# Altium schematic sheet eVV_Main Controller.SchDoc: eVV_Main Controller
size A4; DrawnBy: Ivica Matovic; Revision: 1.1; SheetNumber: 5; SheetTotal: 8
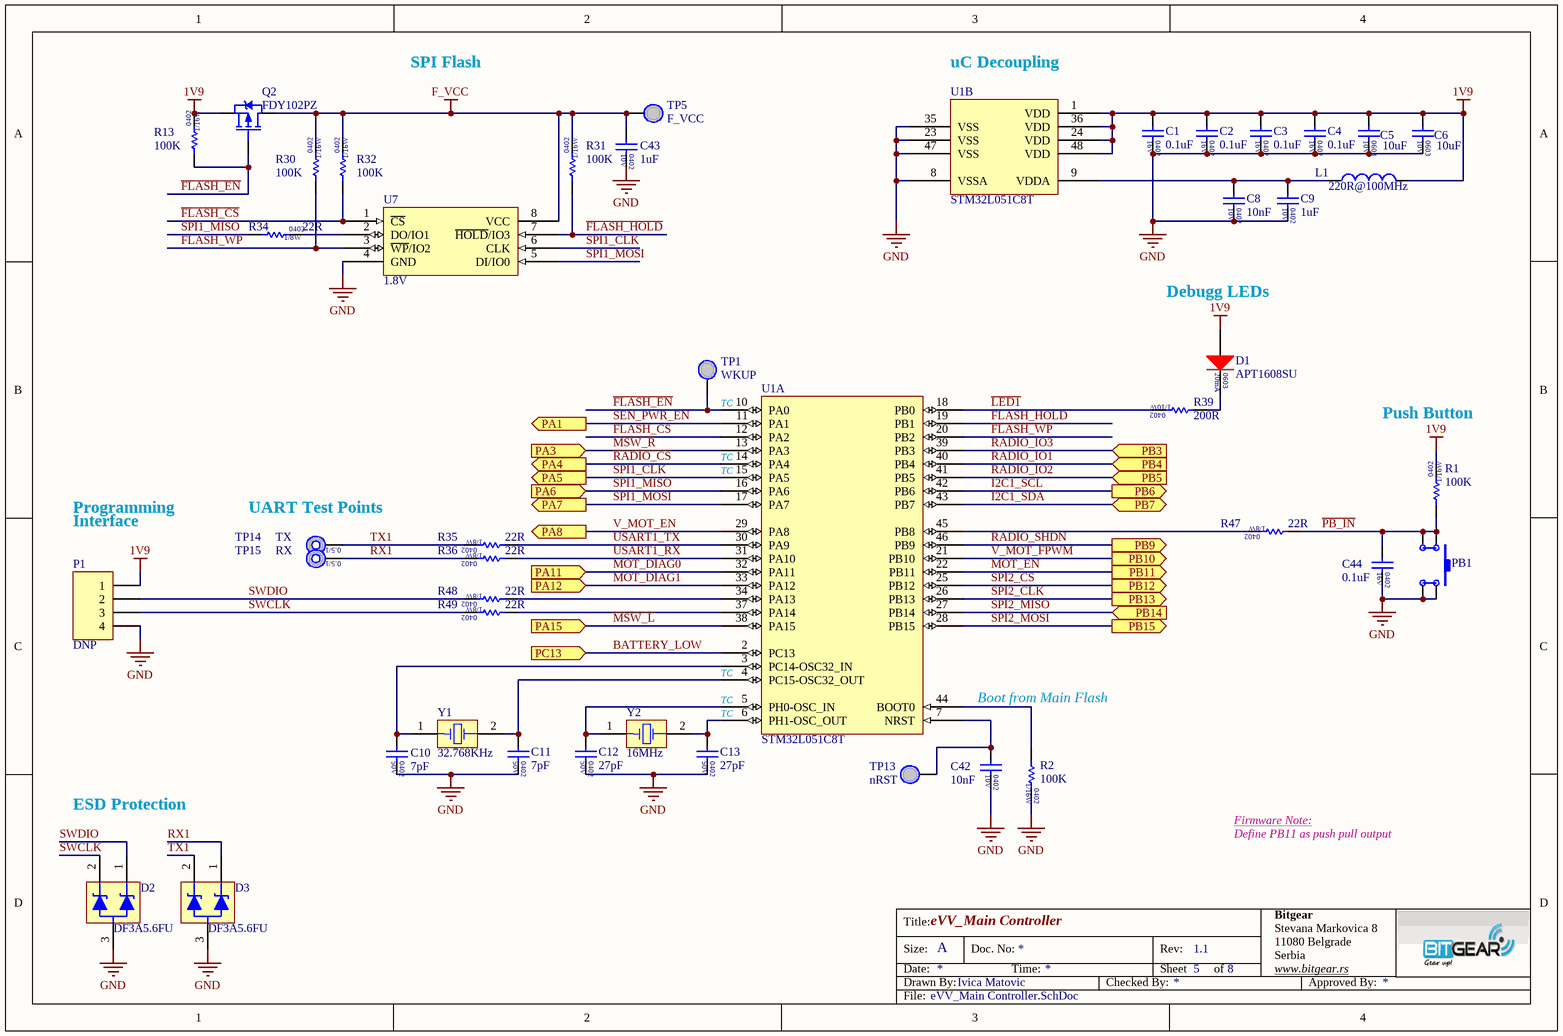
[diagram p0: eVV_Main Controller.SchDoc]

## Parts
C1  0.1uF  [CAPC1005X60N]
C2  0.1uF  [CAPC1005X60N]
C3  0.1uF  [CAPC1005X60N]
C4  0.1uF  [CAPC1005X60N]
C5  10uF  [CAPC1608X95N]
C6  10uF  [CAPC1608X95N]
C8  10nF  [CAPC1005X60N]
C9  1uF  [CAPC1005X60N]
C10  7pF  [CAPC1005X60N]
C11  7pF  [CAPC1005X60N]
C12  27pF  [CAPC1005X60N]
C13  27pF  [CAPC1005X60N]
C42  10nF  [CAPC1005X60N]
C43  1uF  [CAPC1005X60N]
C44  0.1uF  [CAPC1005X60N]
D1  APT1608SU  [DIOC1608X84N_R]
D2  DF3A5.6FU  [SOT65P210X110-3N]
D3  DF3A5.6FU  [SOT65P210X110-3N]
L1  220R@100MHz  [INDC1005X60N]
P1  DNP  [HDR1X4_100MIL]  (no BOM)
PB1  switch  [CK_KMR221NG]  (value not drawn)
Q2  FDY102PZ  [SOT50P160X78-3N]
R1  100K  [RESC1005X40AN]
R2  100K  [RESC1005X40AN]
R13  100K  [RESC1005X40AN]
R30  100K  [RESC1005X40AN]
R31  100K  [RESC1005X40AN]
R32  100K  [RESC1005X40AN]
R34  22R  [RESC1005X40AN]
R35  22R  [RESC1005X40AN]
R36  22R  [RESC1005X40AN]
R39  200R  [RESC1005X40AN]
R47  22R  [RESC1005X40AN]
R48  22R  [RESC1005X40AN]
R49  22R  [RESC1005X40AN]
TP1  WKUP  [TEST_POINT_1MM]  (no BOM)
TP5  F_VCC  [TEST_POINT_1MM]  (no BOM)
TP13  nRST  [TEST_POINT_1MM]  (no BOM)
TP14  TX  [TEST_POINT_TH_1MM]  (no BOM)
TP15  RX  [TEST_POINT_TH_1MM]  (no BOM)
U1  STM32L051C8T  [QFP50P900X900X160-48N]  (parts A,B of 2)
U7  1.8V  [SOIC127P600X175-8N]
Y1  32.768KHz  [ABS07]
Y2  16MHz  [ABM3]

## Ports
PA1 (out), PA3 (in), PA4 (out), PA5 (out), PA6 (in), PA7 (out), PA8 (out), PA11 (in), PA12 (in), PA15 (in), PB3 (in), PB4 (in), PB5 (in), PB6 (out), PB7 (bidir), PB9 (out), PB10 (out), PB11 (out), PB12 (out), PB13 (out), PB14 (in), PB15 (out), PC13 (in)

## Nets
1V9: C1.1 C2.1 C3.1 C4.1 C5.1 C6.1 D1.1(A) L1.2 P1.1 Q2.2(S) R1.1 R13.1 U1.1(VDD) U1.24(VDD) U1.36(VDD) U1.48(VDD)
F_VCC: C43.1 Q2.3(D) R30.1 R31.1 R32.1 TP5.1 U7.8(VCC)
GND: C1.2 C2.2 C3.2 C4.2 C5.2 C6.2 C8.2 C9.2 C10.2 C11.2 C12.2 C13.2 C42.2 C43.2 C44.2 D2.3(A) D3.3(A) P1.4 PB1.3 PB1.4 R2.1 U1.8(VSSA) U1.23(VSS) U1.35(VSS) U1.47(VSS) U7.4(GND)
~{LED1}: R39.1 U1.18(PB0)
~{MSW_L}: U1.38(PA15) ; port PA15
~{MSW_R}: U1.13(PA3) ; port PA3
~{PB_IN}: C44.1 PB1.1 PB1.2 R1.2 R47.2
BATTERY_LOW: U1.2(PC13) ; port PC13
~{FLASH_CS}: R32.2 U1.12(PA2) U7.1(~{CS})
~{FLASH_EN}: Q2.1(G) R13.2 TP1.1 U1.10(PA0)
~{FLASH_HOLD}: R31.2 U1.19(PB1) U7.7(~{HOLD}/IO3)
~{FLASH_WP}: R30.2 U1.20(PB2) U7.3(~{WP}/IO2)
I2C1_SCL: U1.42(PB6) ; port PB6
I2C1_SDA: U1.43(PB7) ; port PB7
MOT_DIAG0: U1.32(PA11) ; port PA11
MOT_DIAG1: U1.33(PA12) ; port PA12
MOT_EN: U1.22(PB11) ; port PB11
~{RADIO_CS}: U1.14(PA4) ; port PA4
RADIO_IO1: U1.40(PB4) ; port PB4
RADIO_IO2: U1.41(PB5) ; port PB5
RADIO_IO3: U1.39(PB3) ; port PB3
RADIO_SHDN: U1.46(PB9) ; port PB9
RX1: D3.1(C1) R36.1 TP15.1
SEN_PWR_EN: U1.11(PA1) ; port PA1
SPI1_CLK: U1.15(PA5) U7.6(CLK) ; port PA5
SPI1_MISO: R34.2 U1.16(PA6) ; port PA6
SPI1_MOSI: U1.17(PA7) U7.5(DI/IO0) ; port PA7
SPI2_CLK: U1.26(PB13) ; port PB13
SPI2_CS: U1.25(PB12) ; port PB12
SPI2_MISO: U1.27(PB14) ; port PB14
SPI2_MOSI: U1.28(PB15) ; port PB15
SWCLK: D2.2(C2) P1.3 R49.1
SWDIO: D2.1(C1) P1.2 R48.1
TX1: D3.2(C2) R35.1 TP14.1
USART1_RX: R36.2 U1.31(PA10)
USART1_TX: R35.2 U1.30(PA9)
V_MOT_EN: U1.29(PA8) ; port PA8
V_MOT_FPWM: U1.21(PB10) ; port PB10
NetC8_1: C8.1 C9.1 L1.1 U1.9(VDDA)
NetC10_1: C10.1 U1.3(PC14-OSC32_IN) Y1.1(OSC1)
NetC11_1: C11.1 U1.4(PC15-OSC32_OUT) Y1.2(COM)
NetC12_1: C12.1 U1.5(PH0-OSC_IN) Y2.1(OSC1)
NetC13_1: C13.1 U1.6(PH1-OSC_OUT) Y2.2(COM)
NetC42_1: C42.1 TP13.1 U1.7(NRST)
NetD1_2: D1.2(C) R39.2
NetR2_2: R2.2 U1.44(BOOT0)
NetR34_1: R34.1 U7.2(DO/IO1)
NetR47_1: R47.1 U1.45(PB8)
NetR48_2: R48.2 U1.34(PA13)
NetR49_2: R49.2 U1.37(PA14)

## Notes on the sheet
- SPI Flash
- (near U1) uC Decoupling
- Debugg LEDs
- TC
- Push Button
- Programming
- UART Test Points
- (near U1) TC
- Interface
- Boot from Main Flash
- ESD Protection
- Firmware Note:
- Define PB11 as push pull output
- Title:
- Bitgear
- Size:
- Date:
- Drawn By:
- A
- Doc. No:
- Time:
- Checked By:
- Sheet
- Rev:
- of
- Stevana Markovica 8
- 11080 Belgrade
- Serbia
- www.bitgear.rs
- Approved By:
- File:
- (in symbol APT1608SU) 20mA; 0603
- (in symbol Cap-1005 (0402) CER 0.1UF 16V X7R 10%) 16V
- (in symbol Cap-1005 (0402) CER 1uF 10V X5R 10%) 10V
- (in symbol Cap-1005 (0402) CER 7pF 50V C0G 0.5pF) 50V
- (in symbol Cap-1005 (0402) CER 10nF 10V X7R 10%) 10V
- (in symbol Cap-1005 (0402) CER 27pF 50V NP0 5%) 50V
- (in symbol Cap-1608 (0603) CER 10uF 10V X5R 20%) 10V
- (in symbol Res-1005 (0402) 22 Ohm 1/8W 1%) 0402; 1/8W
- (in symbol Res-1005 (0402) 100 KOhm 1/16W 1%) 1/16W; 0402
- (in symbol Res-1005 (0402) 200 Ohm 1/10W 5%) 1/10W; 0402
- (in symbol TP TH) 0.5/1

## Library data of the parts
C1-C4 C44 = Cap-1005 (0402) CER 0.1UF 16V X7R 10%: CAP CER 0.1UF 0402 (1005) 16V X7R 10%; Manufacturer: Murata Electronics North America; D P/N: 490-3261-1-ND; D Price: 0.1; M P/N: GRM155R71C104KA88D; S MOQ: 10000; S P/N: 490-3261-2-ND; S Price: 0.00462; Distributor: Digikey; Mounting: SMD; Supplier: Digi Key; Package: 0402; Value: 0.1uF
C5 C6 = Cap-1608 (0603) CER 10uF 10V X5R 20%: Capacitor Ceramic 10uF 1608 (0603) 10V X5R 20%; Manufacturer: Taiyo Yuden; D P/N: 587-3412-1-ND; D Price: 0.4; M P/N: LMK107BBJ106MAHT; S MOQ: 4000; S P/N: 587-3412-2-ND; S Price: 0.08296; Distributor: Digikey; Mounting: SM; Supplier: Digi Key; Package: 0603; Value: 10uF
C8 C42 = Cap-1005 (0402) CER 10nF 10V X7R 10%: Manufacturer: Samsung; D P/N: 1276-1502-1-ND; D Price: 0.1; M P/N: CL05B103KP5NNNC; S MOQ: 10000; S P/N: 1276-1502-2-ND; S Price: 0.00216; Distributor: Digikey; Mounting: SMD; Supplier: Digi Key; Package: 0402; Value: 10nF
C9 C43 = Cap-1005 (0402) CER 1uF 10V X5R 10%: Manufacturer: Murata Electronics North America; D P/N: 490-3890-1-ND; D Price: 0.18; M P/N: GRM155R61A105KE15D; S MOQ: 10000; S P/N: 490-3890-2-ND; S Price: 0.01323; Distributor: Digikey; Mounting: SMD; Supplier: Digi Key; Package: 0402; Value: 1uF
C10 C11 = Cap-1005 (0402) CER 7pF 50V C0G 0.5pF: Manufacturer: Murata Electronics North America; D P/N: 490-5878-1-ND; D Price: 0.13; M P/N: GRM1555C1H7R0DA01D; S MOQ: 10000; S Price: TBD; Distributor: Digikey; Mounting: SMD; Supplier: Rutronik; Package: 0402; Value: 7pF
C12 C13 = Cap-1005 (0402) CER 27pF 50V NP0 5%: CAP CER 27PF 50V 5% NP0 0402 (1005); Manufacturer: Murata Electronics North America; D P/N: 490-5869-1-ND; D Price: 0.13; M P/N: GRM1555C1H270JA01D; S MOQ: 10000; S P/N: 490-5869-2-ND; S Price: 0.00483; Distributor: Digikey; Mounting: SM; Supplier: Digi Key; Package: 0402; Value: 27pF
D1 = APT1608SU: LED Red 0603 20mA; Manufacturer: Kingbright; D P/N: 754-1123-1-ND; D Price: 0.19; M P/N: APT1608SURCK; S MOQ: 2000; S P/N: 754-1123-2-ND; S Price: 0.062; Distributor: Digikey; Mounting: SMD; Supplier: Digi Key; Package: 0402; Value: Red
D2 D3 = DF3A5.6FU: 30kV ESD Protection Diode, Vr=2.5V, Vz=5.6V, Ilkg=1uA; Manufacturer: Toshiba Semiconductor; M P/N: DF3A5.6LFU(TE85L,F); D P/N: DF3A5.6LFU(TE85LF)CT-ND; D Price: 0.41; S MOQ: 1000; S Price: 0.076; Value: 5.6V; Mounting: SMD; Distributor: Digikey; Supplier: Digi Key; S P/N: DF3A5.6LFU(TE85LF)CT-ND
L1 = FBead-1005 (0402) 220 Ohm 800mA: FERRITE BEAD 220 Ohm 800mA 0402; Manufacturer: Taiyo Yuden; D P/N: 587-2088-1-ND; D Price: 0.1; M P/N: BKP1005HS221-T; S MOQ: 10000; S P/N: 587-2088-2-ND; S Price: 0.01503; Value: 220Ohm; Distributor: Digikey; Mounting: SM; Supplier: Digi Key
P1 = Header 4: Header, 4-Pin
PB1 = KMR221NG: Push Button SPST-NO 4.6X2.8mm; Manufacturer: C&K Components; D P/N: CKN10244CT-ND; D Price: 0.59; M P/N: KMR221NGLFS; S MOQ: 7000; S P/N: CKN10244TR-ND; S Price: 0.26544; Distributor: Digikey; Mounting: SM; Supplier: Digi Key
Q2 = FDY102PZ: P-MOSFET Single 0.83A Low Vgs; Manufacturer: Fairchild; D Price: 0.46; M P/N: FDY102PZCT-ND; S P/N: FDY102PZTR-ND; S Price: 0.08514; S MOQ: 3000; D P/N: FDY102PZ; Distributor: Digikey; Value: FDY102PZ; Mounting: SMD; Package: SC89-3; Supplier: Digi Key
R1 R2 R13 R30-R32 = Res-1005 (0402) 100 KOhm 1/16W 1%: Manufacturer: Vishay Dale; D P/N: 311-100KLRCT-ND; D Price: 0.1; M P/N: RC0402FR-07100KL; S MOQ: 10000; S P/N: 311-100KLRTR-ND; S Price: 0.00152; Distributor: Digikey; Mounting: SM; Supplier: Digi Key; Value: 100K
R34-R36 R47-R49 = Res-1005 (0402) 22 Ohm 1/8W 1%: Manufacturer: Vishay Dale; D P/N: 541-22.0YCT-ND; D Price: 0.020; M P/N: CRCW040222R0FKEDHP; S MOQ: 10000; S P/N: 541-22.0YTR-ND; S Price: 0.02376; Distributor: Digikey; Mounting: SM; Supplier: Digi Key; Value: 22R
R39 = Res-1005 (0402) 200 Ohm 1/10W 5%: Manufacturer: Vishay Dale; D P/N: P200JCT-ND; D Price: 0.1; M P/N: ERJ-2GEJ201X; S MOQ: 10000; S P/N: P200JTR-ND; S Price: 0.00198; Distributor: Digikey; Mounting: SM; Supplier: Digi Key; Value: 200R
TP1 TP5 TP13 = TP: Test point; D P/N: TESTP; D Price: 0; M P/N: TESTP; Mounting: SM
TP14 TP15 = TP TH: Test point Through Hole; D P/N: TESTP; D Price: 0; M P/N: TESTP; Mounting: SM
U1 = STM32L051C8T: 48-Pin, Access line, ultra-low-power, 32-bit MCU; Manufacturer: ST Microelectronics; M P/N: STM32L051C8T6; D P/N: 497-14900-ND; D Price: 3.77; S MOQ: 1000 No Stock; S Price: 1.8872; Mounting: SMD; Distributor: Digikey; Supplier: Digi Key; S P/N: 497-14900-ND
U7 = W25Q80BW: SPI Flash 8Mbit 1.8V 7uA sleep current; Manufacturer: Winbond Electronics; M P/N: W25Q80BWSNIG; D P/N: W25Q80BWSNIG-ND; D Price: 0.50; S MOQ: 1000; S Price: 0.38; Mounting: SMD; Distributor: Digikey; Supplier: Digi Key; S P/N: W25Q80BWSNIG-ND; Value: 1.8V
Y1 = ABS07-32.768KHz 7pF: Crystal 32.768KHZ 3.2mm x 1.5 mm 7pF; Manufacturer: Abracon Corporation; D P/N: 535-9543-1-ND; D Price: 1.04; M P/N: ABS07-32.768KHZ-7-T; S MOQ: 1000; S Price: 0.6; Distributor: Digikey; Mounting: SM; S P/N: 535-9543-1-ND; Supplier: Digi Key; Package: 2-SMD; Value: 32.768KHz
Y2 = ABM3-16.000: Crystal Oscillator 16MHz 5.0X3.2mm; Manufacturer: Abracon; M P/N: ABM3-16.000MHZ-B2-T; D P/N: 535-9103-1-ND; D Price: 1.04; S MOQ: 500; S Price: 0.7182; Value: 25MHz; Distributor: Digi Key; Mounting: SM; S P/N: 535-9103-1-ND; Supplier: Digi Key